# EAGLE design SparkoStat (EAGLE 7.3.0)
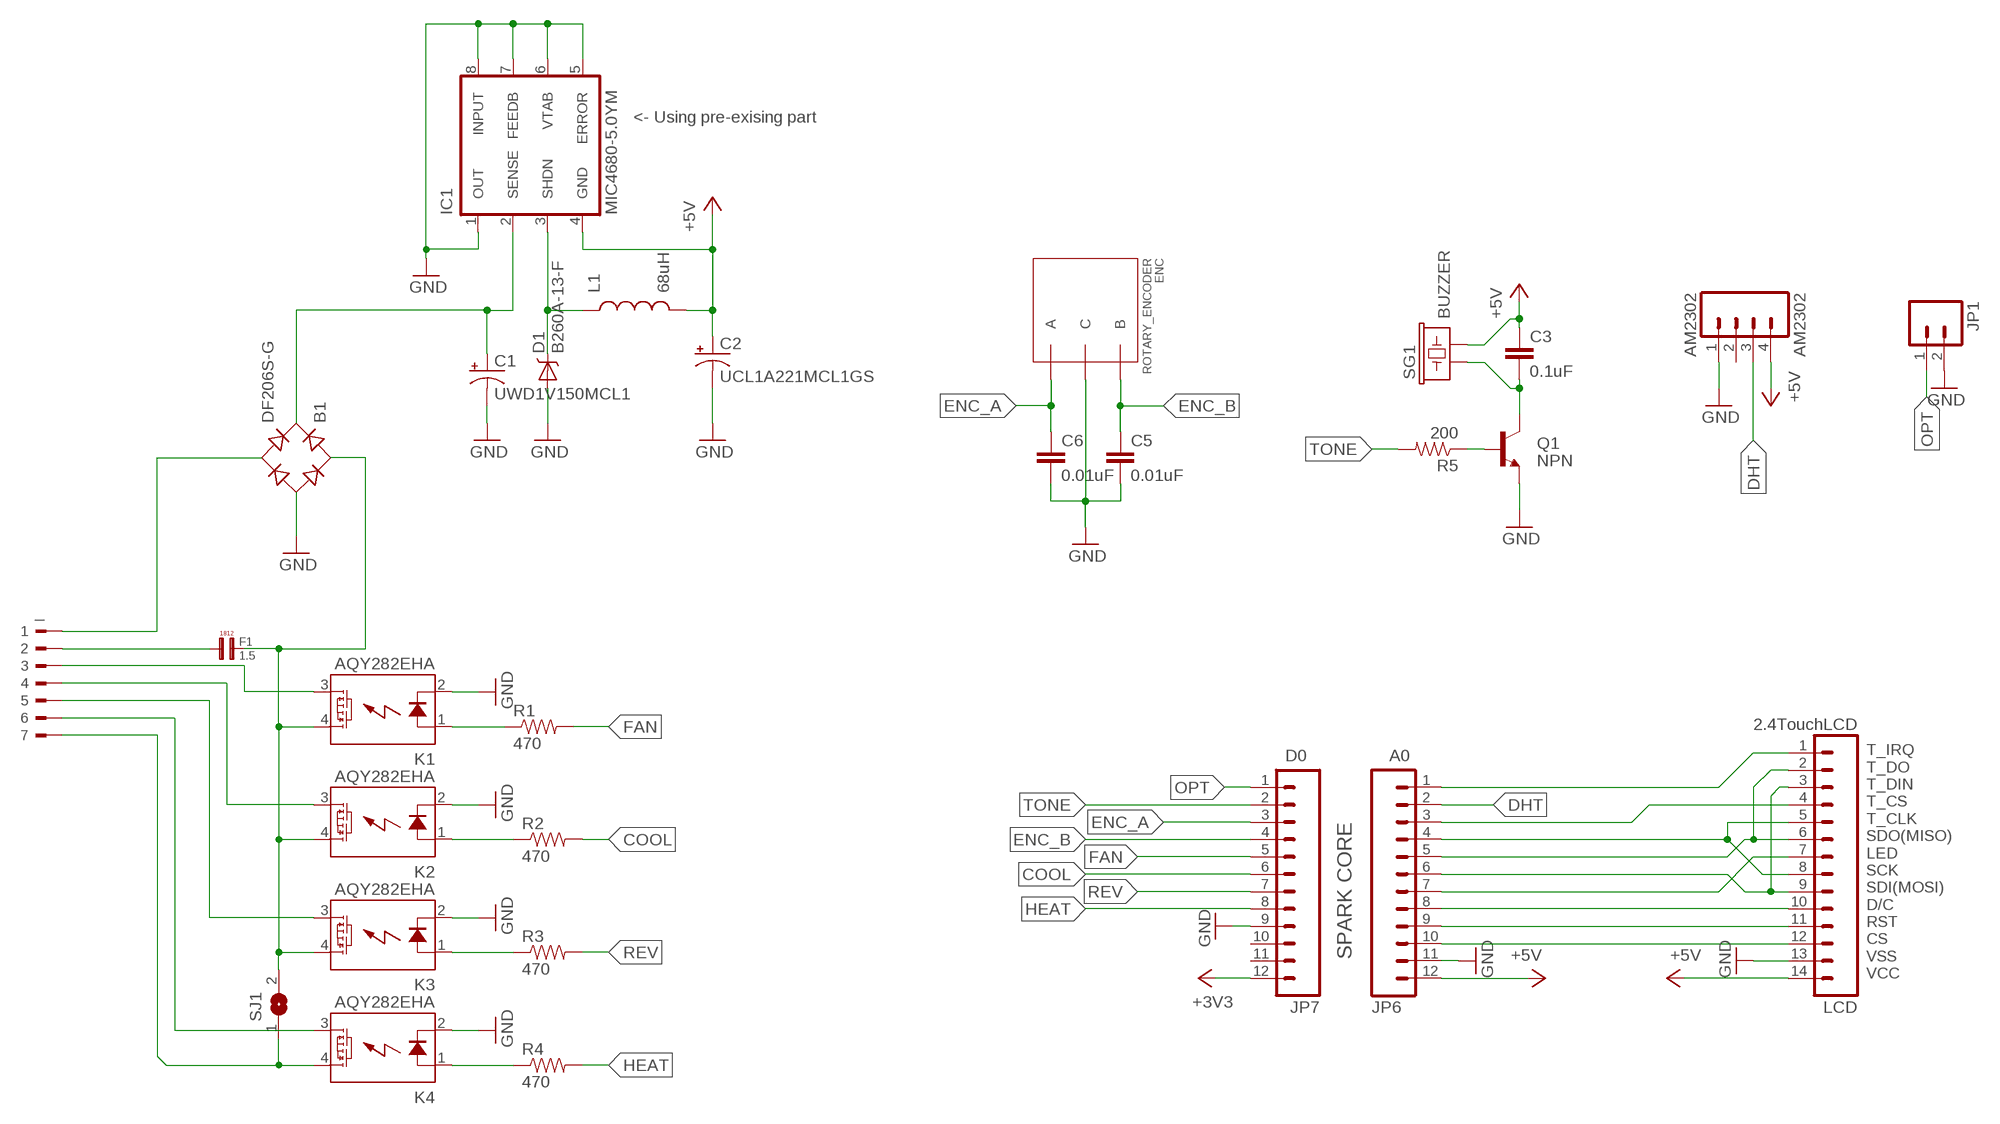
[diagram p0: schematic, sheet 1]

## Parts
_  180-7  [180-7]
AM2302  AM2302  M04PTH  [1X04]
B1  DF206S-G  DF01S  [DFS]
C1  UWD1V150MCL1  CAP_POLC  [PANASONIC_C]
C2  UCL1A221MCL1GS  CAP_POLD  [PANASONIC_D]
C3  0.1uF  CAP0805  [0805]
C5  0.01uF  CAP0805  [0805]
C6  0.01uF  CAP0805  [0805]
D1  B260A-13-F  DIODE-SCHOTTKY_  [SMA-DIODE]
ENC  ROTARY_ENCODER  [ROTORY_ENC]
F1  1.5  0,1ÂµF  [L4,8]
IC1  MIC4680-5.0YM  LP2951ACM  [SO-08]
JP1  M02PTH  [1X02]
JP6  M12LOCK  [1X12_LOCK]
JP7  M12LOCK  [1X12_LOCK]
K1  AQY282EHA  AQY22SOP  [SOP04]
K2  AQY282EHA  AQY22SOP  [SOP04]
K3  AQY282EHA  AQY22SOP  [SOP04]
K4  AQY282EHA  AQY22SOP  [SOP04]
L1  68uH  INDUCTORDR1030  [DR1030]
LCD  2.4TouchLCD  M14LOCK  [1X14_LOCK]
Q1  NPN  TRANSISTOR_NPNSOT23  [SOT23]
R1  470  RESISTOR0805-RES  [0805]
R2  470  RESISTOR0805-RES  [0805]
R3  470  RESISTOR0805-RES  [0805]
R4  470  RESISTOR0805-RES  [0805]
R5  200  RESISTOR0805-RES  [0805]
SG1  BUZZER  BUZZERNS  [BUZZER-12MM-NS]
SJ1  SJ  [SJ]

## Nets
+3V3: JP7.12
+5V: AM2302.4 C2.+ C3.1 IC1.4(GND) JP6.12 L1.2 LCD.14 SG1.-
COOL: JP7.6 R2.2
DHT: AM2302.3 JP6.2
ENC_A: C6.1 ENC.A JP7.3
ENC_B: C5.1 ENC.B JP7.4
FAN: JP7.5 R1.2
GND: AM2302.1 B1.- C1.- C2.- C5.2 C6.2 D1.A ENC.C IC1.1(OUT) IC1.5(ERROR) IC1.6(VTAB) IC1.7(FEEDB) IC1.8(INPUT) JP1.2 JP6.11 JP7.9 K1.2(K) K2.2(K) K3.2(K) K4.2(K) LCD.13 Q1.2(E)
HEAT: JP7.8 R4.2
N$1: JP6.1 LCD.1
N$2: D1.C IC1.3(SHDN) L1.1
N$3: _.6 K4.3(DS2)
N$4: K1.1(A) R1.1
N$7: K2.1(A) R2.1
N$9: B1.AC1 F1.P$2 K1.4(DS1) K2.4(DS1) K3.4(DS1) SJ1.2
N$10: K3.1(A) R3.1
N$11: K4.1(A) R4.1
N$13: _.4 K2.3(DS2)
N$15: _.3 K1.3(DS2)
N$20: _.1 B1.AC2
N$22: JP6.6 LCD.3 LCD.9
N$23: JP6.5 LCD.2 LCD.6
N$24: B1.+ C1.+ IC1.2(SENSE)
N$25: JP6.9 LCD.11
N$26: JP6.10 LCD.12
N$27: JP6.8 LCD.10
N$28: JP6.4 LCD.5 LCD.8
N$29: _.5 K3.3(DS2)
N$30: JP6.7 LCD.7
N$32: _.2 F1.P$1
N$34: C3.2 Q1.3(C) SG1.+
N$35: JP6.3 LCD.4
N$36: _.7 K4.4(DS1) SJ1.1
N$39: Q1.1(B) R5.1
OPT: JP1.1 JP7.1
REV: JP7.7 R3.2
TONE: JP7.2 R5.2
Unconnected: AM2302.2 JP7.10 JP7.11

## Notes on the sheet
- <- Using pre-exising part
- T_IRQ
  T_DO
  T_DIN
  T_CS
  T_CLK
  SDO(MISO)
  LED
  SCK
  SDI(MOSI)
  D/C
  RST
  CS
  VSS
  VCC
- D0 | A0
- SPARK CORE

## Library data of the parts
_ = con-weidmueller-sl35:180-7: WEIDMUELLER CLAMP CONNECTOR; OC_FARNELL: unknown; OC_NEWARK: unknown
AM2302 = SparkFun-Connectors:M04: Header 4 Standard 4-pin 0.1" header. Use with straight break away headers (SKU : PRT-00116), right angle break away headers (PRT-00553), swiss pins (PRT-00743), machine pins (PRT-00117), and female headers (PRT-00115). Molex polarized connector foot print use with SKU : PRT-08231 with associated crimp pins and housings. 1MM SMD Version SKU: PRT-10208
B1 = rectifier:DF*S: Surface Mount Glass Passivated Bridge Rectifiers Source: Source: Comchip Bridge Rectifiers DF005S-G thru DF10S-G.pdf
C1 C2 = SparkFun-Capacitors:CAP_POL: Capacitor Polarized These are standard SMD and PTH capacitors. Normally 10uF, 47uF, and 100uF in electrolytic and tantalum varieties. Always verify the external diameter of the through hole cap, it varies with capacity, voltage, and manufacturer. The EIA devices should be standard.
C3 C5 C6 = SparkFun-Capacitors:CAP: Capacitor Standard 0603 ceramic capacitor, and 0.1" leaded capacitor.
D1 = SparkFun-DiscreteSemi:DIODE-SCHOTTKY: Commonly MBRA140.
ENC = CuriousTech:ROTARY_ENCODER: Panasonic EVEG Rotary Encoder
F1 = Capacitor-Wima-SMD1812-100v:0,1ÂµF
IC1 = v-reg:LP2951?*: Series of Adjustable Micropower Voltage Regulators Source: http://cache.national.com/ds/LP/LP2950.pdf
JP1 = SparkFun-Connectors:M02: Header 2 Standard 2-pin 0.1" header. Use with straight break away headers (SKU : PRT-00116), right angle break away headers (PRT-00553), swiss pins (PRT-00743), machine pins (PRT-00117), and female headers (PRT-00115). Molex polarized connector foot print use with SKU : PRT-08233 with associated crimp pins and housings.
JP6 JP7 = SparkFun-Connectors:M12: Header 12 Standard 12-pin 0.1" header. Use with straight break away headers (SKU : PRT-00116), right angle break away headers (PRT-00553), swiss pins (PRT-00743), machine pins (PRT-00117), and female headers (PRT-00115).
K1-K4 = relay:AQY*: PhotoMOS Relay NAiS Source: http://www.panasonic-electric-works.com/catalogues/downloads/photomos/ds_x615_en_aqz10_20.pdf; OC_FARNELL: unknown; OC_NEWARK: unknown
L1 = SparkFun-Passives:INDUCTOR: Inductors Basic Inductor/Choke - 0603 and 1206. Footprints are not proven and vary greatly between part numbers.
LCD = SparkFun-Connectors:M14: Header 14 Standard 14-pin 0.1" header. Use with straight break away headers (SKU : PRT-00116), right angle break away headers (PRT-00553), swiss pins (PRT-00743), machine pins (PRT-00117), and female headers (PRT-00115).
Q1 = SparkFun-DiscreteSemi:TRANSISTOR_NPN: Generic NPN BJT. MMBT2222 is the common NPN we use. Double check against datasheet- not all devices are the same!
R1-R5 = SparkFun-Passives:RESISTOR: Resistor Basic schematic elements and footprints for 0603, 1206, and PTH resistors.
SG1 = SparkFun-Electromechanical:BUZZER: Buzzer 12mm Spark Fun Electronics SKU : Comp-Buzzer
SJ1 = jumper:SJ: SMD solder JUMPER

## Board
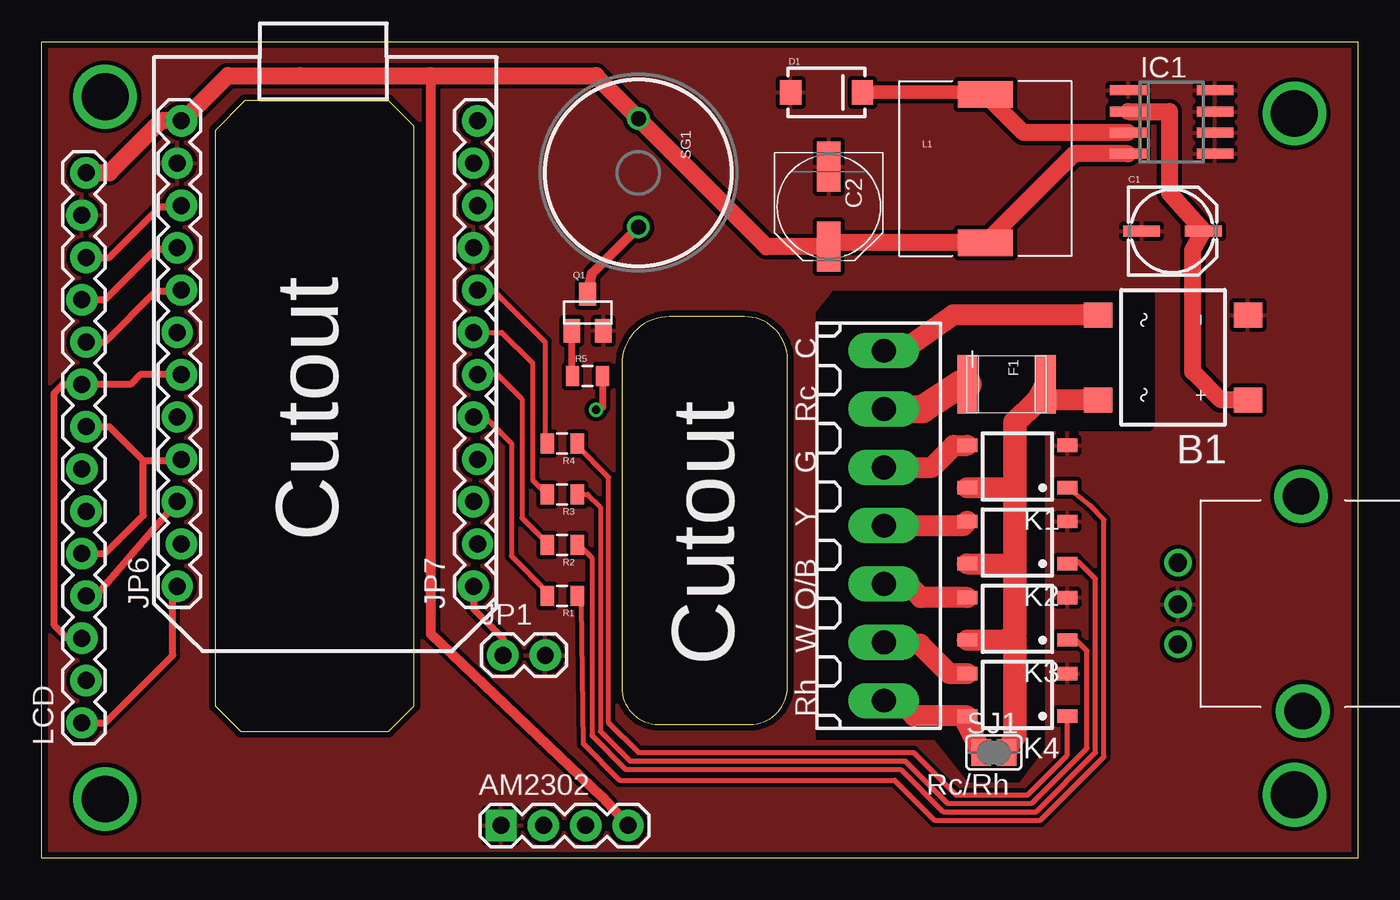
[diagram p1: board, top side]
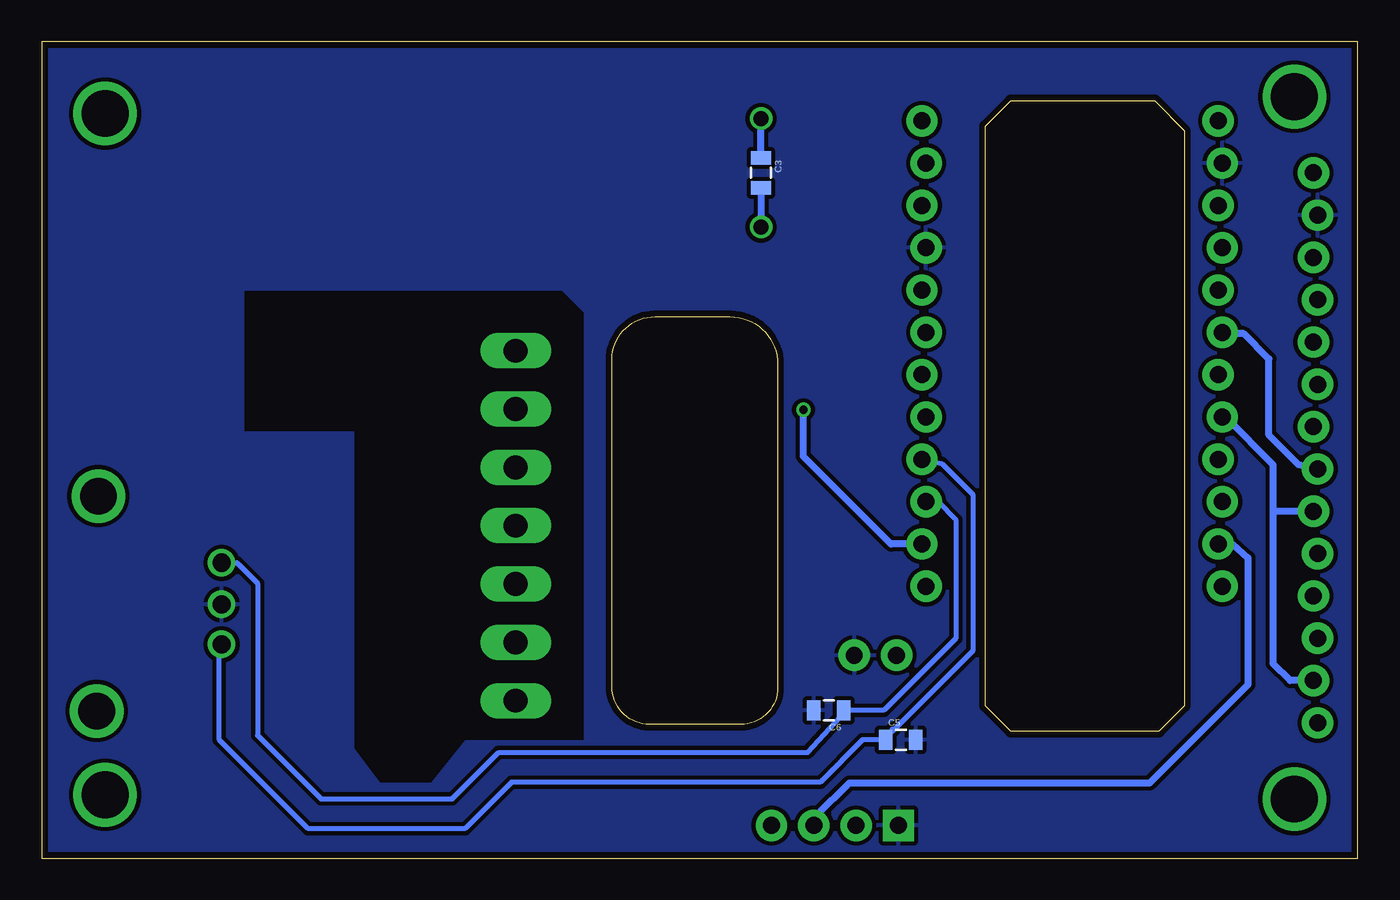
[diagram p2: board, bottom side, seen from below]

Size 78.99 x 49.02 mm. Coordinates in mm from the lower left corner, seen from the top.
Outline: 78.99,0 0,0 0,49.02 78.99,49.02 78.99,0
Outline: 44.77,10.3 44.77,29.93 arc90 42.19,32.51 37.68,32.51 arc90 34.82,29.65 34.82,10.24 arc90 37.02,8.04 42.51,8.04 arc90 44.77,10.3
Outline: 10.41,43.69 10.41,9.14 11.94,7.62 20.83,7.62 22.35,9.14 22.35,43.94 20.83,45.47 12.19,45.47 10.41,43.69
Copper layers (1*16): Top 0.0356mm / dielectric 1.5011mm / Bottom 0.0356mm
Design rules "LaenPCBOrder": minimum track width 6mil, minimum drill 13mil, track to track 6mil, track to pad 6mil, pad to pad 6mil, via to via 6mil, smd to smd 6mil, copper to edge 15mil, drill to drill 6mil, minimum pad ring 7mil, minimum via ring 7mil, stop-mask expansion 4mil, vias tented up to drill 0mil, thermal gap 10mil

### Footprints (pad centres in the part's own frame; a part is rotated, then mirrored left to right if it is on the bottom)
180-7 = drill 1.422 long: 1 -10.5,0; 2 -7,0; 3 -3.5,0; 4 0,0; 5 3.5,0; 6 7,0; 7 10.5,0
1X04 = drill 1.016 pad 1.88 square: 1 0,0 | drill 1.016 pad 1.88: 2 2.54,0; 3 5.08,0; 4 7.62,0
DFS = smd 1.5 x 1.7: + -2.55,-4.5; - 2.55,-4.5; AC1 -2.55,4.5; AC2 2.55,4.5
PANASONIC_C = smd 2.2 x 0.65: + 1.9,-0.2; - -1.8,-0.2
PANASONIC_D = smd 3 x 1.4: + 2.4,0; - -2.4,0
0805 = smd 0.8 x 1.2: 1 -0.9,0; 2 0.9,0
SMA-DIODE = smd 1.27 x 1.47: A -2.15,0; C 2.15,0
ROTORY_ENC = drill 1.1: A -7.5,2.5; B -7.5,-2.4; C -7.5,0 | drill 2.2: P$1 -0.1,6.5; P$2 0,-6.4
L4,8 = smd 3.5 x 1.2: P$1 0,-2.35; P$2 0,2.35
SO-08 = smd 0.6 x 2.2: 1 -1.905,-2.6; 2 -0.635,-2.6; 3 0.635,-2.6; 4 1.905,-2.6; 5 1.905,2.6; 6 0.635,2.6; 7 -0.635,2.6; 8 -1.905,2.6
1X02 = drill 1.016 pad 1.88: 1 0,0; 2 2.54,0
1X12_LOCK = drill 1.016 pad 1.88: 1 0,0.127; 2 2.54,-0.127; 3 5.08,0.127; 4 7.62,-0.127; 5 10.16,0.127; 6 12.7,-0.127; 7 15.24,0.127; 8 17.78,-0.127; 9 20.32,0.127; 10 22.86,-0.127; 11 25.4,0.127; 12 27.94,-0.127
SOP04 = smd 0.8 x 1.2: 1 -1.27,-3; 2 1.27,-3; 3 1.27,3; 4 -1.27,3
DR1030 = smd 3.3 x 1.6: 1 0,4.45; 2 0,-4.45
1X14_LOCK = drill 1.016 pad 1.88: 1 0,0.127; 2 2.54,-0.127; 3 5.08,0.127; 4 7.62,-0.127; 5 10.16,0.127; 6 12.7,-0.127; 7 15.24,0.127; 8 17.78,-0.127; 9 20.32,0.127; 10 22.86,-0.127; 11 25.4,0.127; 12 27.94,-0.127; 13 30.48,0.127; 14 33.02,-0.127
SOT23 = smd 1 x 1.4: 1 -0.95,-1.1; 2 0.95,-1.1; 3 0,1.1
BUZZER-12MM-NS = drill 0.9: + 3.25,0; - -3.25,0
SJ = smd 1.168 x 1.6: 1 -0.762,0; 2 0.762,0

### Placement (x,y rotation side)
_  50.55,19.96 270 top
AM2302  27.57,1.97 0 top
B1  67.9,30.07 90 top
C1  67.82,37.85 0 top
C2  47.24,39.12 270 top
C3  35.81,41.15 270 bottom
C5  27.43,7.11 0 bottom
C6  31.75,8.89 180 bottom
D1  47.11,45.98 0 top
ENC  75.69,15.24 0 top
F1  57.91,28.45 270 top
IC1  67.82,44.2 270 top
JP1  27.69,12.19 0 top
JP6  8.26,16.33 90 top
JP7  26.04,16.33 90 top
K1  58.56,23.52 90 top
K2  58.56,18.95 90 top
K3  58.56,14.38 90 top
K4  58.56,9.81 90 top
L1  56.64,41.4 0 top
LCD  2.54,8.13 90 top
Q1  32.77,32.77 0 top
R1  31.24,15.75 180 top
R2  31.24,18.8 180 top
R3  31.24,21.84 180 top
R4  31.24,24.89 180 top
R5  32.77,28.96 0 top
SG1  35.81,41.15 270 top
SJ1  57.15,6.35 0 top

### Tracks (layer width: path | path; a pad name or v marks a point on that pad's centre or on a via)
+5V
  Top 0.61: 8.45,44.27 JP6.12 8.13,44.27 | 10.92,46.74 15.49,46.99 | AM2302.4 33.67,3.67 23.37,13.46 23.37,46.99
  Top 1.016: LCD.14 4.06,41.15 7.18,44.27 8.13,44.27 | 8.45,44.27 10.92,46.74 11.18,46.99 15.49,46.99 23.37,46.99 33.27,46.99 33.27,46.94 SG1.- 43.5,36.72 C2.+ 47.48,36.95 L1.2 | 57.41,37.21 L1.2 | IC1.4 61.98,42.29 L1.2
  Bottom 0.406: C3.1 SG1.-
COOL
  Top 0.305: JP7.6 27.36,29.03 28.83,27.56 28.83,20.44 30.34,18.92 R2.2
DHT
  Bottom 0.406: JP6.2 7.55,18.87 6.6,18.03 6.6,10.41 12.51,4.51 30.54,4.51 32.51,2.54 32.77,2.11 AM2302.3
ENC_A
  Bottom 0.305: JP7.3 25.22,21.41 24.13,20.32 24.13,13.21 28.45,8.89 30.73,8.89 | ENC.A 67.27,17.74 66.04,16.51 66.04,7.37 62.23,3.56 54.36,3.56 51.56,6.35 33.02,6.35 30.73,8.89 | C6.1 30.73,8.89
ENC_B
  Bottom 0.305: JP7.4 24.96,23.69 23.11,21.84 23.11,12.45 27.94,7.62 27.94,7.76 C5.1 29.72,7.11 32.26,4.57 50.8,4.57 53.59,1.78 62.99,1.78 68.33,7.11 68.33,12.97 ENC.B
FAN
  Top 0.305: R1.2 30.34,16 28.19,18.15 28.19,24.89 26.6,26.49 JP7.5
GND
  pour Top (isolate 0.254): 0,0 78.94,0 78.94,34.34 78.99,34.54 78.94,49.02 0,49.28
  pour Bottom (isolate 0.254): 0,-0.25 0,49.28 78.99,49.02 78.99,0 0.25,0
  cutout Top (isolate 0.254): 46.48,32.77 46.48,7.11 53.59,7.11 55.63,4.57 58.67,4.57 60.2,6.6 60.2,25.4 60.71,25.65 66.55,25.65 66.8,25.91 66.8,34.04 47.5,34.04
  cutout Bottom (isolate 0.254): 46.48,32.77 46.48,7.11 53.59,7.11 55.63,4.57 58.67,4.57 60.2,6.6 60.2,25.65 66.8,25.65 66.8,34.04 47.75,34.04
HEAT
  Top 0.305: JP7.8 27.11,34.11 30.23,30.99 30.23,25.01 R4.2
N$1
  Top 0.406: LCD.1 3.81,8.13 7.87,12.19 7.87,16.07 JP6.1
N$2
  Top 0.813: D1.C 56.64,45.98 L1.1
  Top 1.016: IC1.3 58.93,43.56 L1.1
N$3
  Top 1.27: K4.3 54.49,11.08 52.71,12.85 50.54,12.85 _.6
N$4
  Top 0.305: K1.1 62.84,21.24 63.75,20.32 63.75,6.1 59.94,2.29 53.59,2.29 51.19,4.69 34.68,4.69 32.51,6.86 32.4,15.24 R1.1
N$5  (via drill 2.8)
  other vias: 3.81,3.56
N$6  (via drill 2.8)
  other vias: 75.18,44.7
N$7
  Top 0.305: K2.1 61.71,17.78 62.23,17.78 63.25,16.76 63.25,6.35 59.69,2.79 54.1,2.79 51.56,5.33 35.05,5.33 33.02,7.37 33.02,18.03 32.26,18.8 R2.1
N$8  (via drill 2.8)
  other vias: 3.81,45.72
N$9
  Top 1.27: K3.4 57.81,13.11 | 57.81,13.11 58.42,13.21 58.42,13.52 57.81,13.11 | K1.4 57.81,22.25 58.42,22.35 | K2.4 58.32,17.68 58.42,17.78 | SJ1.2 58.42,7.37 | F1.P$2 60.2,28.38 59.69,27.43 60.36,27.52 B1.AC1
  Top 1.422: 58.42,13.52 58.42,17.78 58.42,22.35 58.42,26.16 59.69,27.43 | 58.42,7.37 58.42,13.21
N$10
  Top 0.305: R3.1 32.77,21.84 33.53,21.08 33.53,7.62 35.31,5.84 51.82,5.84 54.36,3.3 59.44,3.3 62.74,6.6 62.74,12.45 62.08,13.11 K3.1
N$11
  Top 0.305: K4.1 61.56,6.18 59.18,3.81 54.86,3.81 52.32,6.35 35.81,6.35 34.04,8.13 34.04,22.86 32,24.89 R4.1
N$13
  Top 1.27: 55.25,19.97 K2.3 55.3,19.97 _.4
N$15
  Top 1.27: K1.3 54.75,24.79 53.42,23.47 _.3
N$20
  Top 1.27: B1.AC2 54.72,32.62 52.07,30.73 50.7,30.73 _.1
N$22
  Top 0.406: LCD.3 1.52,13.21 0.76,13.97 0.76,27.94 1.27,28.45 LCD.9 5.33,28.45 5.91,29.03 JP6.6
N$23
  Bottom 0.406: LCD.6 5.08,20.83 | 5.08,20.83 5.08,23.62 7.87,26.42 8.06,26.42 | LCD.2 4.06,10.67 5.08,11.68 5.08,20.83
  Bottom 0.61: 8.06,26.42 JP6.5
N$24
  Top 1.016: B1.+ 70.78,27.52 69.09,29.21 69.09,36.51 C1.+ 67.69,39.93 67.69,44.83 IC1.2
N$25
  Top 0.406: LCD.11 3.81,33.53 6.86,36.58 8.06,36.58 JP6.9
N$26
  Top 0.406: LCD.12 4.06,36.07 7.11,39.12 8.31,39.12 JP6.10
N$27
  Top 0.406: LCD.10 3.81,30.99 6.86,34.04 8.31,34.04 JP6.8
N$28
  Top 0.406: LCD.8 4.06,25.91 6.1,23.88 | 6.1,23.88 8.31,23.88 JP6.4 | LCD.5 3.81,18.29 6.1,20.57 6.1,23.88
N$29
  Top 1.27: K3.3 52.77,15.65 51.95,16.47 _.5
N$30
  Bottom 0.406: LCD.7 3.56,23.62 5.33,25.4 5.33,29.97 6.86,31.5 8.06,31.5 JP6.7
N$32
  Top 1.676: _.2 52.87,26.97 55.12,28.45 F1.P$1
N$34
  Top 0.61: Q1.3 33.02,35.1 SG1.+
  Bottom 0.406: C3.2 SG1.+
N$35
  Top 0.305: LCD.4 3.23,15.75
  Top 0.406: 3.23,15.75 JP6.3
N$36
  Top 1.27: SJ1.1 55.37,8.38 55.47,8.28 K4.4 52.37,8.54 51.44,9.47 _.7
N$38  (via drill 2.8)
  other vias: 75.18,3.81
N$39
  Top 0.406: Q1.1 31.82,29.01 R5.1
OPT
  Top 0.406: JP1.1 27.69,13.21 25.91,14.98 JP7.1
REV
  Top 0.305: JP7.7 27.61,31.57 29.46,29.72 29.46,22.72 R3.2
TONE  (via drill 0.5)
  Top 0.406: R5.2 33.67,27.06 v33.27,26.92
  Bottom 0.406: JP7.2 28.01,18.87 33.27,24.13 v33.27,26.92

### Text on the board
tPlace: Cutout | Cutout | Rc/Rh
bStop: CuriousTech.net | Spark-O-Stat
_tsilk: C | Rc | G | Y | O/B | W | Rh